# Altium project switch.PrjPCB
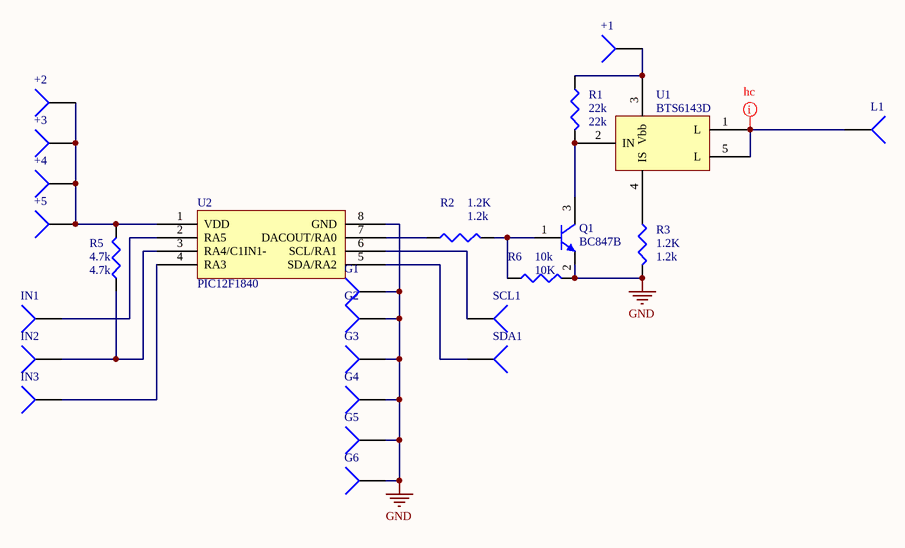
[diagram p0: switch.SchDoc]
1 sheet, 25 parts. Net scope: global (net labels, ports and power ports of the same name join across sheets).
Board file: switch.PcbDoc

## Sheet switch.SchDoc
size A4

### Parts
+1  Socket  [PIN1]  (value not drawn)
+2  Socket  [PIN1L]  (value not drawn)
+3  Socket  [PIN1L]  (value not drawn)
+4  Socket  [PIN1L]  (value not drawn)
+5  Socket  [PIN1L]  (value not drawn)
G1  Socket  [PIN1L]  (value not drawn)
G2  Socket  [PIN1L]  (value not drawn)
G3  Socket  [PIN1L]  (value not drawn)
G4  Socket  [PIN1L]  (value not drawn)
G5  Socket  [PIN1]  (value not drawn)
G6  Socket  [PIN1]  (value not drawn)
IN1  Socket  [PIN1L]  (value not drawn)
IN2  Socket  [PIN1L]  (value not drawn)
IN3  Socket  [PIN1L]  (value not drawn)
L1  Socket  [PIN1]  (value not drawn)
Q1  BC847B  [SOT-23_N]
R1  22k  [J1-0603]
R2  1.2k  [J1-0603]
R3  1.2k  [J1-0603]
R5  4.7k  [J1-0603]
R6  10k  [J1-0603]
SCL1  Socket  [PIN1L]  (value not drawn)
SDA1  Socket  [PIN1L]  (value not drawn)
U1  BTS6143D  [BTS6143D]
U2  PIC12F1840  [SOIC150-8_N]

### Nets
GND: G1.1 G2.1 G3.1 G4.1 G5.1 G6.1 Q1.2(E) R3.2 R6.2 U2.8(GND)
Net+1_1: +1.1 R1.1 U1.3(Vbb)
Net+2_1: +2.1 +3.1 +4.1 +5.1 R5.2 U2.1(VDD)
NetIN1_1: IN1.1 U2.2(RA5)
NetIN2_1: IN2.1 R5.1 U2.3(RA4/C1IN1-)
NetIN3_1: IN3.1 U2.4(RA3)
NetL1_1: L1.1 U1.1(L) U1.5(L)
NetQ1_1: Q1.1(B) R2.2 R6.1
NetQ1_3: Q1.3(C) R1.2 U1.2(IN)
NetR2_1: R2.1 U2.7(DACOUT/RA0)
NetR3_1: R3.1 U1.4(IS)
NetSCL1_1: SCL1.1 U2.6(SCL/RA1)
NetSDA1_1: SDA1.1 U2.5(SDA/RA2)

### Layout directives
net class hc: NetL1_1

### Library data of the parts
Q1 = NPN: NPN Bipolar Transistor; Published: 8-Jun-2000; LatestRevisionDate: 17-Jul-2002; LatestRevisionNote: Re-released for DXP Platform.; PackageReference: TO-226-AA; Publisher: Altium Limited; PackageDescription: TO, Flat Index; 3 In-Line, Axial Leads; Body Dia. 4.8mm; Leads 0.55 x 0.51 mm (max); Code_JEDEC: TO-226-AA
R1-R3 R5 R6 = Res3: Resistor; Published: 8-Jun-2000; LatestRevisionDate: 29-May-2009; LatestRevisionNote: IPC-7351 Footprint Added.; PackageReference: J1-0603; Publisher: Altium Limited; PackageDescription: Chip Resistor
  R1: Value: 22k
  R2 R3: Value: 1.2K
  R5: Value: 4.7k
  R6: Value: 10K
+1-+5 G1-G6 IN1-IN3 L1 SCL1 SDA1 = Socket: LatestRevisionDate: 17-Jul-2002; LatestRevisionNote: Re-released for DXP Platform.; Publisher: Altium Limited